# Altium project Ultra-Mega-PS-V1.00.PrjPcb
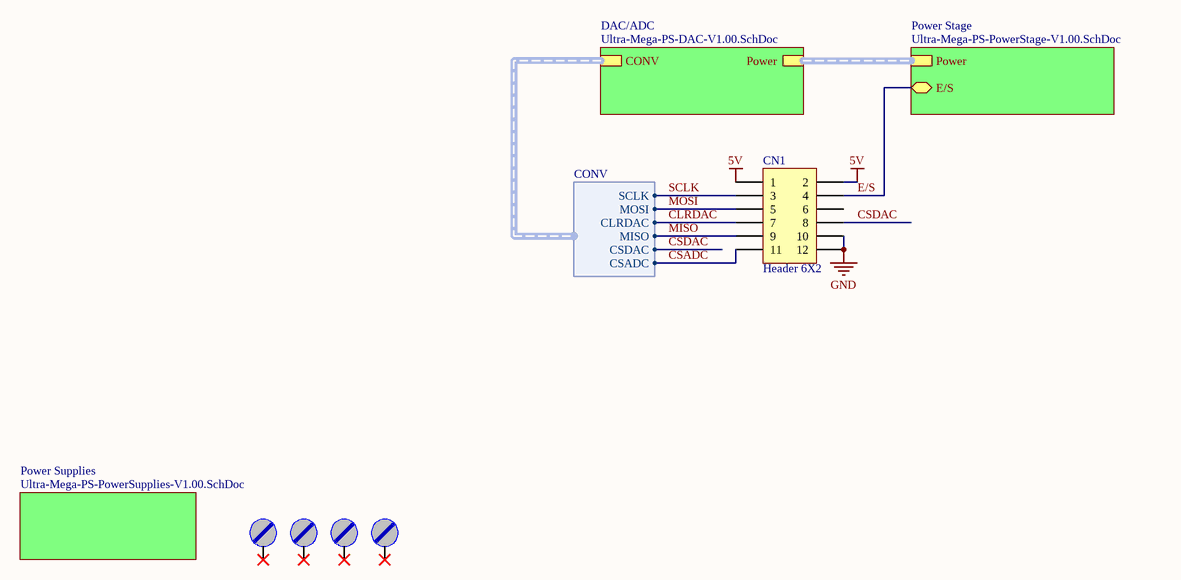
[diagram p0: Ultra-Mega-PS-Block-V1.00.SchDoc]
4 sheets, 104 parts. Net scope: hierarchical (ports join the sheet entries above them; power ports are global).
Board file: Ultra-Mega-PS-PCB.PcbDoc
Sheets:
  Ultra-Mega-PS-Block-V1.00.SchDoc
    DAC/ADC = Ultra-Mega-PS-DAC-V1.00.SchDoc
    Power Stage = Ultra-Mega-PS-PowerStage-V1.00.SchDoc
    Power Supplies = Ultra-Mega-PS-PowerSupplies-V1.00.SchDoc

## Sheet Ultra-Mega-PS-Block-V1.00.SchDoc: Ultra-Mega-PowerSupply
size A4; Author: Felipe Navarro; SheetNumber: 1; SheetTotal: 5

### Parts
CN1  Header 6X2  [CONN HDR2X6]
HOLE1  Furo de Fixação  [Furo_M3]  (value not drawn)  (no BOM)
HOLE2  Furo de Fixação  [Furo_M3]  (value not drawn)  (no BOM)
HOLE3  Furo de Fixação  [Furo_M3]  (value not drawn)  (no BOM)
HOLE4  Furo de Fixação  [Furo_M3]  (value not drawn)  (no BOM)

### Sub-sheets
DAC/ADC = Ultra-Mega-PS-DAC-V1.00.SchDoc: Power (harness Power), CONV (harness CONV)
Power Stage = Ultra-Mega-PS-PowerStage-V1.00.SchDoc: Power (harness Power), E/S
Power Supplies = Ultra-Mega-PS-PowerSupplies-V1.00.SchDoc: no entries

### Harnesses
CONV: SCLK, MOSI, CLRDAC, MISO, CSDAC, CSADC

### Nets
5V: CN1.1 CN1.2
GND: CN1.10 CN1.12
CLRDAC: CN1.7 ; sheet DAC/ADC/CONV.CLRDAC
CSADC: CN1.11 ; sheet DAC/ADC/CONV.CSADC
CSDAC: CN1.8 ; sheet DAC/ADC/CONV.CSDAC
E/S: CN1.4 ; sheet Power Stage/E/S
MISO: CN1.9 ; sheet DAC/ADC/CONV.MISO
MOSI: CN1.5 ; sheet DAC/ADC/CONV.MOSI
SCLK: CN1.3 ; sheet DAC/ADC/CONV.SCLK

Not connected (* = marked no-connect by the designer): CN1 6; HOLE1 X*; HOLE2 X*; HOLE3 X*; HOLE4 X*

### Buses and harness runs
harness sheet DAC/ADC/Power = sheet Power Stage/Power

### Notes on the sheet
- Projeto:
- Tamanho:
- Data:
- A4
- Eng. Felipe Navarro
- Hora:
- Revisão:
- Folha
- de
- Arquivo:

### Library data of the parts
CN1 = Header 6X2: Header, 6-Pin, Dual row; ChinesePrice: 0,00000; Chinês: ----; Corrente: *; Potência: *; Supplier 1: Digi-Key; Supplier Part Number 1: --Del; Tensão: *; Value: *; Obs:: *; Tolerância: *; ComponentLink1Description: Datasheet; ComponentLink1URL: D:\Tecnoclade\Datasheet\!DataMissing.pdf
HOLE1-HOLE4 = Parafuso: Furo para parafuso; Value: M3; ChinesePrice: 0,00000; Chinês: ----; Corrente: *; Potência: *; Supplier 1: Digi-Key; Supplier Part Number 1: --Del; Tensão: *; Obs:: *; Tolerância: *; ComponentLink1Description: Datasheet; ComponentLink1URL: D:\Tecnoclade\Datasheet\!DataMissing.pdf

## Sheet Ultra-Mega-PS-DAC-V1.00.SchDoc: Ultra-Mega-PowerSupply
size A4; Author: Felipe Navarro; SheetNumber: 4; SheetTotal: 5
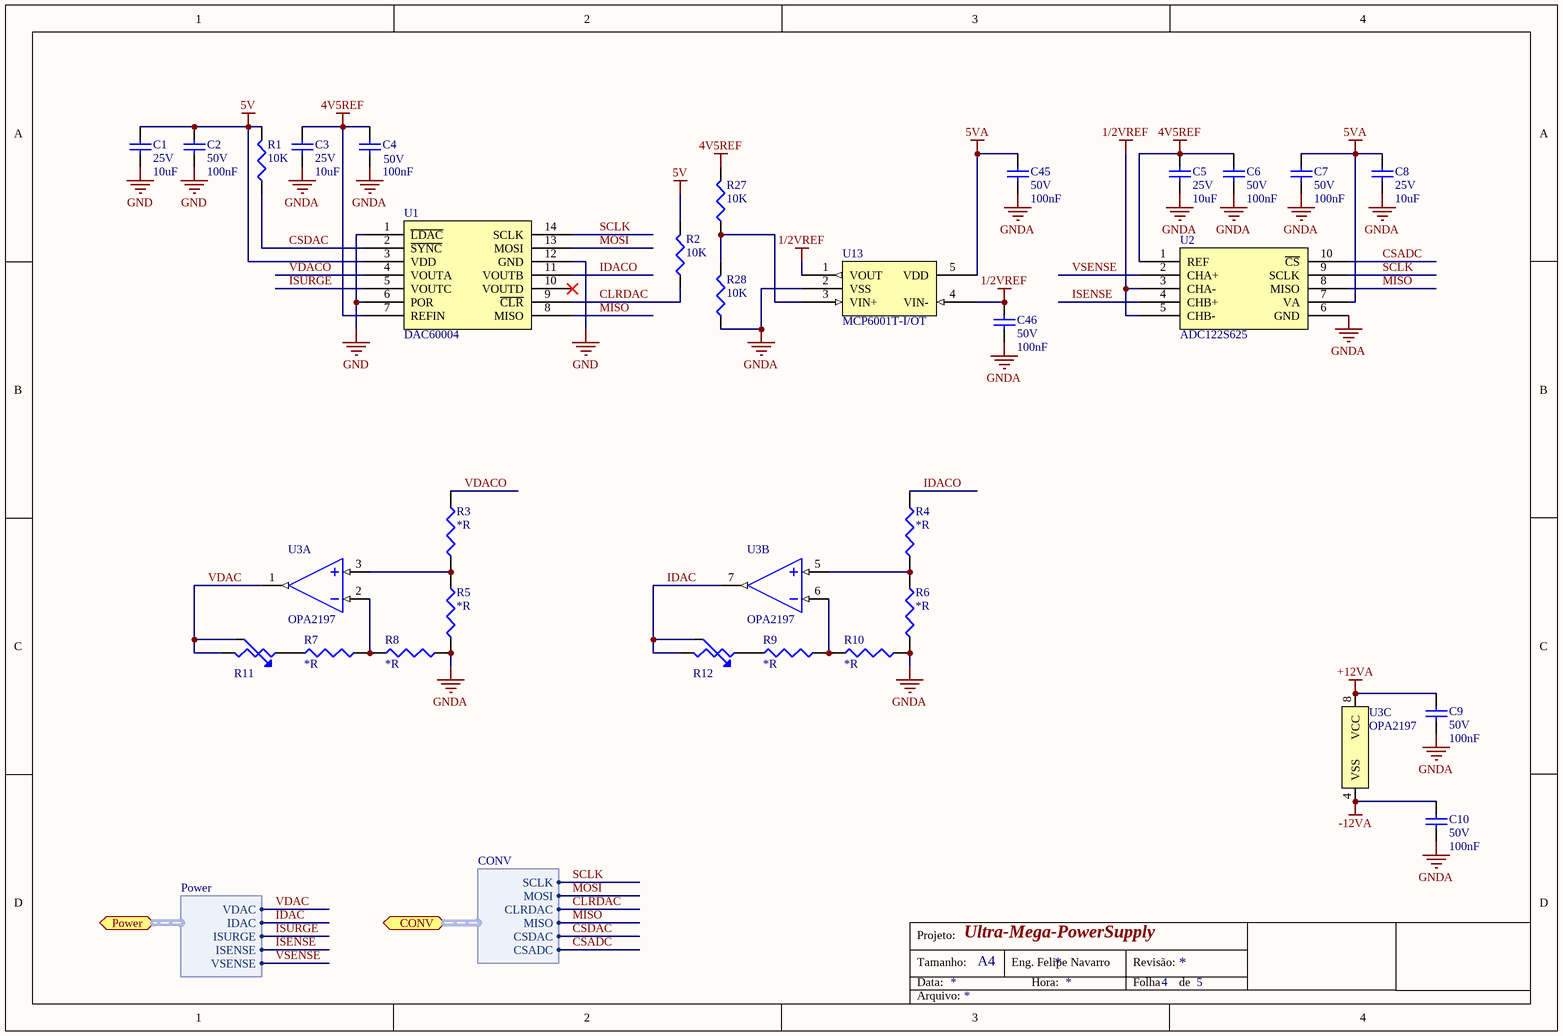
[diagram p1: Ultra-Mega-PS-DAC-V1.00.SchDoc]

### Parts
C1  value 10uF  Tensão: 25V  [CC0805]  (hidden comment: Capacitor Cerâmico)
C2  value 100nF  Tensão: 50V  [CC0603]  (hidden comment: Capacitor Cerâmico)
C3  value 10uF  Tensão: 25V  [CC0805]  (hidden comment: Capacitor Cerâmico)
C4  value 100nF  Tensão: 50V  [CC0603]  (hidden comment: Capacitor Cerâmico)
C5  value 10uF  Tensão: 25V  [CC0805]  (hidden comment: Capacitor Cerâmico)
C6  value 100nF  Tensão: 50V  [CC0603]  (hidden comment: Capacitor Cerâmico)
C7  value 100nF  Tensão: 50V  [CC0603]  (hidden comment: Capacitor Cerâmico)
C8  value 10uF  Tensão: 25V  [CC0805]  (hidden comment: Capacitor Cerâmico)
C9  value 100nF  Tensão: 50V  [CC0603]  (hidden comment: Capacitor Cerâmico)
C10  value 100nF  Tensão: 50V  [CC0603]  (hidden comment: Capacitor Cerâmico)
C45  value 100nF  Tensão: 50V  [CC0603]  (hidden comment: Capacitor Cerâmico)
C46  value 100nF  Tensão: 50V  [CC0603]  (hidden comment: Capacitor Cerâmico)
R1  value 10K  [CC0603]  (hidden comment: Resistor)
R2  value 10K  [CC0603]  (hidden comment: Resistor)
R3  value *R  [CC0603]  (hidden comment: Resistor)
R4  value *R  [CC0603]  (hidden comment: Resistor)
R5  value *R  [CC0603]  (hidden comment: Resistor)
R6  value *R  [CC0603]  (hidden comment: Resistor)
R7  value *R  [CC0603]  (hidden comment: Resistor)
R8  value *R  [CC0603]  (hidden comment: Resistor)
R9  value *R  [CC0603]  (hidden comment: Resistor)
R10  value *R  [CC0603]  (hidden comment: Resistor)
R11  Potenciômetro  [POT]  (value not drawn)
R12  Potenciômetro  [POT]  (value not drawn)
R27  value 10K  [CC0603]  (hidden comment: Resistor)
R28  value 10K  [CC0603]  (hidden comment: Resistor)
U1  DAC60004  [TSSOP-14N]
U2  ADC122S625  [MSOP10]
U3  OPA2197  [SOIC-8N]  (parts A,B,C of 3)
U13  MCP6001T-I/OT  [SOT-23-5N]

### Ports
CONV (harness CONV), Power (harness Power)

### Harnesses
Power: VDAC, IDAC, ISENSE, VSENSE, ISURGE
CONV: SCLK, MOSI, CLRDAC, MISO, CSDAC, CSADC

### Nets
1/2VREF: C46.2 U2.3(CHA-) U2.5(CHB-) U13.1(VOUT) U13.4(VIN-)
4V5REF: C3.2 C4.2 C5.2 C6.2 R27.2 U1.7(REFIN) U2.1(REF)
5V: C1.2 C2.2 R1.2 R2.2 U1.3(VDD)
5VA: C7.2 C8.2 C45.2 U2.7(VA) U13.5(VDD)
+12VA: C9.2 U3.8(VCC)
-12VA: C10.2 U3.4(VSS)
GND: C1.1 C2.1 U1.1(~{LDAC}) U1.6(POR) U1.12(GND)
GNDA: C3.1 C4.1 C5.1 C6.1 C7.1 C8.1 C9.1 C10.1 C45.1 C46.1 R5.1 R6.1 R8.2 R10.2 R28.1 U2.6(GND) U13.2(VSS)
CLRDAC: R2.1 U1.9(~{CLR}) ; port CONV.CLRDAC
CSADC: U2.10(~{CS}) ; port CONV.CSADC
CSDAC: R1.1 U1.2(~{SYNC}) ; port CONV.CSDAC
IDAC: R12.2(TAP) R12.3 U3.7(OUTB) ; port Power.IDAC
IDACO: R4.2 U1.11(VOUTB)
ISENSE: U2.4(CHB+) ; port Power.ISENSE
ISURGE: U1.5(VOUTC) ; port Power.ISURGE
MISO: U1.8(MISO) U2.8(MISO) ; port CONV.MISO
MOSI: U1.13(MOSI) ; port CONV.MOSI
SCLK: U1.14(SCLK) U2.9(SCLK) ; port CONV.SCLK
VDAC: R11.2(TAP) R11.3 U3.1(OUTA) ; port Power.VDAC
VDACO: R3.2 U1.4(VOUTA)
VSENSE: U2.2(CHA+) ; port Power.VSENSE
NetR3_1: R3.1 R5.2 U3.3(INA+)
NetR4_1: R4.1 R6.2 U3.5(INB+)
NetR7_1: R7.1 R11.1
NetR7_2: R7.2 R8.1 U3.2(INA-)
NetR9_1: R9.1 R12.1
NetR9_2: R9.2 R10.1 U3.6(INB-)
NetR27_1: R27.1 R28.2 U13.3(VIN+)

Not connected (* = marked no-connect by the designer): U1 10(VOUTD)*

### Notes on the sheet
- Projeto:
- Tamanho:
- Data:
- A4
- Eng. Felipe Navarro
- Hora:
- Revisão:
- Folha
- de
- Arquivo:

### Library data of the parts
C1 C3 C5 C8 = Cap 10uF 25V 0805 X5R: Capacitor (Semiconductor SIM Model); Chinês: Local; ChinesePrice: 0,02620; Corrente: *A; Potência: *W; Obs:: X5R; Tolerância: ±10%; Supplier 1: Digi-Key; Supplier Part Number 1: 587-2985-1-ND; ComponentLink1Description: Datasheet; ComponentLink1URL: D:\Tecnoclade\Datasheet\!DataMissing.pdf
C2 C4 C6 C7 C9 C10 C45 C46 = Cap 100nF 50V 0603 X7R: Capacitor (Semiconductor SIM Model); Chinês: Local; ChinesePrice: 0,00250; Corrente: *A; Potência: *W; Obs:: X7R; Tolerância: ±10%; Supplier 1: Digi-Key; Supplier Part Number 1: 1276-1000-1-ND; ComponentLink1Description: Datasheet; ComponentLink1URL: D:\Tecnoclade\Datasheet\!DataMissing.pdf
R1 R2 R27 R28 = Res 10K 1% 0603 1/10W: ChinesePrice: 0,00089; Chinês: Local; Corrente: *A; Potência: 1/10W; Tensão: *V; Tolerância: ±1%; Supplier 1: Digi-Key; Supplier Part Number 1: P10.0KHCT-ND; Obs: *; ComponentLink1Description: Datasheet; ComponentLink1URL: D:\Tecnoclade\Datasheet\!DataMissing.pdf
R3-R10 = Res - $Val $% $Footprint $Pot: ChinesePrice: 0,00000; Chinês: ----; Corrente: *A; Potência: 1/10W; Tensão: *V; Tolerância: ±*%; Supplier 1: Digi-Key; Supplier Part Number 1: --Del; Obs:: *; ComponentLink1Description: Datasheet; ComponentLink1URL: D:\Tecnoclade\Datasheet\!DataMissing.pdf
R11 R12 = Res Trim: Trimmer; ChinesePrice: 0,00000; Chinês: ----; Corrente: *A; Potência: *W; Tensão: *V; Tolerância: ±*%; Value: 1K; Supplier 1: Digi-Key; Supplier Part Number 1: --Del; Obs: *; ComponentLink1Description: Datasheet; ComponentLink1URL: D:\Tecnoclade\Datasheet\!DataMissing.pdf
U1 = DAC6004: DACx0004, Quad 16-,14-,12-Bit, 1 LSB INL, Buffered, Voltage-Output Digital-to-Analog  Converters; ChinesePrice: 0,00000; Chinês: ----; Supplier 1: Digi-Key; Supplier Part Number 1: *; Corrente: *; Potência: *; Tensão: *; Value: *; Obs:: *; Tolerância: *; ComponentLink1Description: Datasheet; ComponentLink1URL: D:\Tecnoclade\Datasheet\
U2 = ADC122S625: ADC122S625 Dual 12-Bit, 50 kSPS to 200 kSPS, Simultaneous Sampling A/D Converter; ChinesePrice: 0,00000; Chinês: ----; Supplier 1: Digi-Key; Corrente: *; Potência: *; Tensão: *; Value: *; Obs:: *; Tolerância: *; ComponentLink1Description: Datasheet; ComponentLink1URL: D:\Tecnoclade\Datasheet\
U3 = OPA2197: OPAx197 36-V, Precision, Rail-to-Rail Input/Output, Low Offset Voltage, Operational Amplifiers; Chinês: ----; ChinesePrice: 0,00000; Tensão: 36V; Value: 10MHz; Corrente: 65mA; Potência: *; Supplier 1: Digi-Key; Obs:: Rail-To-Rail; Tolerância: *; ComponentLink1Description: Datasheet; ComponentLink1URL: D:\Tecnoclade\Datasheet\
U13 = MCP6001: 1 MHz, Low-Power Op Amp; ChinesePrice: 0,00000; Chinês: ----; Tensão: 3V75 ~ 6V; Corrente: 500mA; Obs:: +; Potência: *; Value: *; Supplier 1: Digi-Key; Supplier Part Number 1: MCP6001T-I/OTCT-ND; Tolerância: *; ComponentLink1Description: Datasheet; ComponentLink1URL: http://ww1.microchip.com/downloads/en/DeviceDoc/21733j.pdf

## Sheet Ultra-Mega-PS-PowerStage-V1.00.SchDoc: Ultra-Mega-PowerSupply
size A4; Author: Felipe Navarro; Revision: 1.0; SheetNumber: 5; SheetTotal: 5; ProjectName: Ultra-Mega-Power-Supply
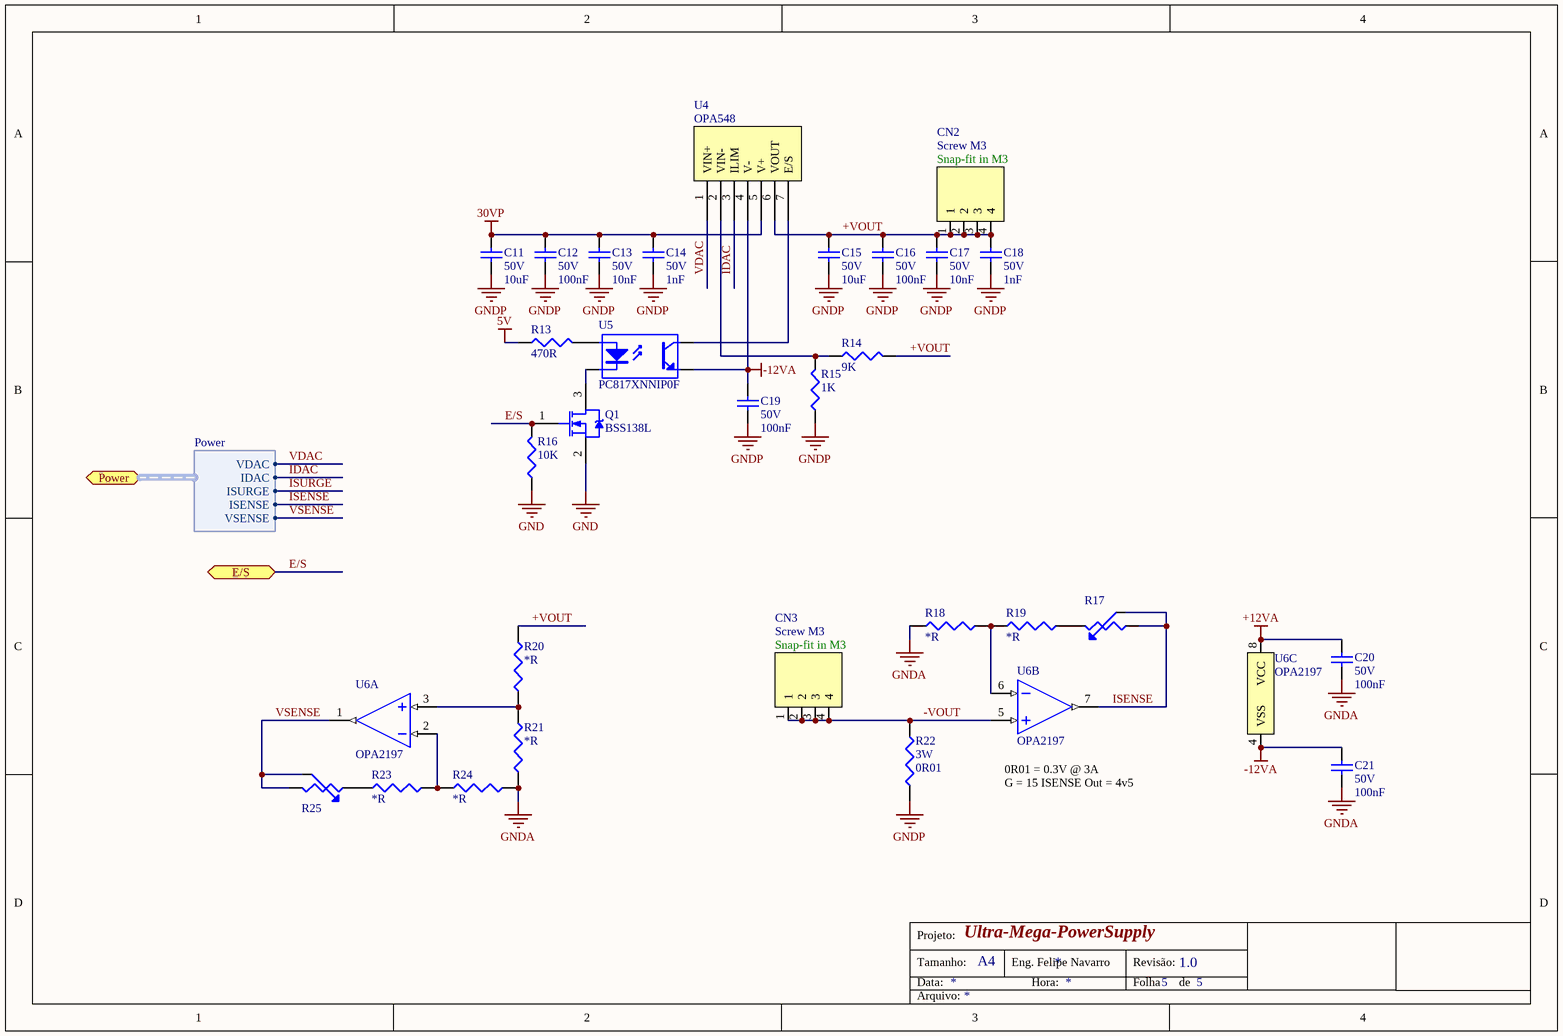
[diagram p2: Ultra-Mega-PS-PowerStage-V1.00.SchDoc]

### Parts
C11  value 10uF  Tensão: 50V  [CC1206]  (hidden comment: Capacitor Cerâmico)
C12  value 100nF  Tensão: 50V  [CC0603]  (hidden comment: Capacitor Cerâmico)
C13  value 10nF  Tensão: 50V  [CC0603]  (hidden comment: Capacitor Cerâmico)
C14  value 1nF  Tensão: 50V  [CC0603]  (hidden comment: Capacitor Cerâmico)
C15  value 10uF  Tensão: 50V  [CC1206]  (hidden comment: Capacitor Cerâmico)
C16  value 100nF  Tensão: 50V  [CC0603]  (hidden comment: Capacitor Cerâmico)
C17  value 10nF  Tensão: 50V  [CC0603]  (hidden comment: Capacitor Cerâmico)
C18  value 1nF  Tensão: 50V  [CC0603]  (hidden comment: Capacitor Cerâmico)
C19  value 100nF  Tensão: 50V  [CC0603]  (hidden comment: Capacitor Cerâmico)
C20  value 100nF  Tensão: 50V  [CC0603]  (hidden comment: Capacitor Cerâmico)
C21  value 100nF  Tensão: 50V  [CC0603]  (hidden comment: Capacitor Cerâmico)
CN2  Screw M3  value Snap-fit in M3  [CONN_MASSA-M3]
CN3  Screw M3  value Snap-fit in M3  [CONN_MASSA-M3]
Q1  BSS138L  [SOT-23-3N]
R13  value 470R  [CC0603]  (hidden comment: Resistor)
R14  value 9K  [CC0603]  (hidden comment: Resistor)
R15  value 1K  [CC0603]  (hidden comment: Resistor)
R16  value 10K  [CC0603]  (hidden comment: Resistor)
R17  Potenciômetro  [POT]  (value not drawn)
R18  value *R  [CC0603]  (hidden comment: Resistor)
R19  value *R  [CC0603]  (hidden comment: Resistor)
R20  value *R  [CC0603]  (hidden comment: Resistor)
R21  value *R  [CC0603]  (hidden comment: Resistor)
R22  value 0R01  Potência: 3W  [CC2512]  (hidden comment: Resistor)
R23  value *R  [CC0603]  (hidden comment: Resistor)
R24  value *R  [CC0603]  (hidden comment: Resistor)
R25  Potenciômetro  [POT]  (value not drawn)
U4  OPA548  [TO-220-7N]
U5  PC817XNNIP0F  [SMD-4N]
U6  OPA2197  [SOIC-8N]  (parts A,B,C of 3)

### Ports
E/S, Power (harness Power)

### Harnesses
Power: VDAC, IDAC, ISENSE, VSENSE, ISURGE

### Nets
5V: R13.1
30VP: C11.2 C12.2 C13.2 C14.2 U4.5(V+)
+12VA: C20.2 U6.8(VCC)
-12VA: C19.2 C21.2 U4.4(V-) U5.3(S) U6.4(VSS)
GND: Q1.2(S) R16.1
GNDA: C20.1 C21.1 R18.1 R21.1 R24.2
GNDP: C11.1 C12.1 C13.1 C14.1 C15.1 C16.1 C17.1 C18.1 C19.1 R15.1 R22.1
+VOUT: C15.2 C16.2 C17.2 C18.2 CN2.1 CN2.2 CN2.3 CN2.4 R14.1 R20.2 U4.6(VOUT)
-VOUT: CN3.1 CN3.2 CN3.3 CN3.4 R22.2 U6.5(INB+)
E/S: Q1.1(G) R16.2 ; port E/S
IDAC: U4.3(ILIM) ; port Power.IDAC
ISENSE: R17.2(TAP) R17.3 U6.7(OUTB) ; port Power.ISENSE
VDAC: U4.1(VIN+) ; port Power.VDAC
VSENSE: R25.2(TAP) R25.3 U6.1(OUTA) ; port Power.VSENSE
NetQ1_3: Q1.3(D) U5.2(K)
NetR13_2: R13.2 U5.1(A)
NetR14_2: R14.2 R15.2 U4.2(VIN-)
NetR17_1: R17.1 R19.2
NetR18_2: R18.2 R19.1 U6.6(INB-)
NetR20_1: R20.1 R21.2 U6.3(INA+)
NetR23_1: R23.1 R25.1
NetR23_2: R23.2 R24.1 U6.2(INA-)
NetU4_7: U4.7(E/S) U5.4(D)

### Notes on the sheet
- (near U6) 0R01 = 0.3V @ 3A
  G = 15 ISENSE Out = 4v5
- Projeto:
- Tamanho:
- Data:
- A4
- Eng. Felipe Navarro
- Hora:
- Revisão:
- Folha
- de
- Arquivo:

### Library data of the parts
C11 C15 = Cap 10uF 50V 1206 X5R: Capacitor (Semiconductor SIM Model); Chinês: -----; ChinesePrice: 0,00000; Corrente: *A; Potência: *W; Obs:: X5R, CL31A106KBHNNNE; Tolerância: ±10%; Supplier 1: Digi-Key; Supplier Part Number 1: 1276-2876-1-ND; ComponentLink1Description: Datasheet; ComponentLink1URL: D:\Tecnoclade\Datasheet\!DataMissing.pdf
C12 C16 C19-C21 = Cap 100nF 50V 0603 X7R: as C2 on sheet Ultra-Mega-PS-DAC-V1.00; Supplier 1: Digi-Key; Supplier Part Number 1: 1276-1000-1-ND; ComponentLink1Description: Datasheet; ComponentLink1URL: D:\Tecnoclade\Datasheet\!DataMissing.pdf
C13 C17 = Cap 10nF 50V 0603 X7R 5%: Capacitor (Semiconductor SIM Model); Chinês: Local; ChinesePrice: 0,00320; Corrente: *A; Potência: *W; Obs:: X7R; Tolerância: ±5%; Supplier 1: Digi-Key; Supplier Part Number 1: 399-1092-1-ND; ComponentLink1Description: Datasheet; ComponentLink1URL: D:\Tecnoclade\Datasheet\!DataMissing.pdf
C14 C18 = Cap 1nF 50V 0603 X7R: Capacitor (Semiconductor SIM Model); Chinês: -----; ChinesePrice: 0,00000; Corrente: *A; Potência: *W; Obs:: X7R; Tolerância: ±10%; Supplier 1: Digi-Key; Supplier Part Number 1: 1276-1916-1-ND; ComponentLink1Description: Datasheet; ComponentLink1URL: D:\Tecnoclade\Datasheet\!DataMissing.pdf
CN2 CN3 = Screw Snap-Fit M3: TERM PCB SNAP-IN VERT M3 THREAD; ChinesePrice: 0,00000; Chinês: -----; Corrente: 15A; Obs:: Screw Terminal, Power Tap; Potência: *; Supplier 1: Digi-Key; Supplier Part Number 1: 7788K-ND; Tensão: *; Tolerância: *; ComponentLink1Description: Datasheet; ComponentLink1URL: D:\Tecnoclade\Datasheet\!DataMissing.pdf
Q1 = TRS BSS138 50V 200mA SOT-23-3N: N-Channel Power MOSFET; ChinesePrice: 0,02950; Chinês: Local; Corrente: 200mA; Potência: 1/5W; Tensão: 50V; Supplier 1: Digi-Key; Supplier Part Number 1: BSS138LT3GOSCT-ND; Value: *; Obs:: *; Tolerância: *; ComponentLink1Description: Datasheet; ComponentLink1URL: D:\Tecnoclade\Datasheet\!DataMissing.pdf
R13 = Res 470R 5% 0603 1/10W: ChinesePrice: 0,00000; Chinês: ----; Corrente: *A; Potência: 1/10W; Tensão: *V; Obs: ±200ppm/ºC; Tolerância: ±5%; Supplier 1: Digi-Key; Supplier Part Number 1: RMCF0603JT470RCT-ND; ComponentLink1Description: Datasheet; ComponentLink1URL: D:\Tecnoclade\Datasheet\!DataMissing.pdf
R14 = Res 9K09 1% 0603 1/10W: ChinesePrice: 0,00000; Chinês: ----; Corrente: *A; Potência: 1/10W; Tensão: *V; Obs: ±100ppm/ºC; Tolerância: ±1%; Supplier 1: Digi-Key; Supplier Part Number 1: RMCF0603FT9K0CT-ND; ComponentLink1Description: Datasheet; ComponentLink1URL: D:\Tecnoclade\Datasheet\!DataMissing.pdf
R15 = Res 1K 1% 0603 1/10W: ChinesePrice: 0,00089; Chinês: Local; Corrente: *A; Potência: 1/10W; Tensão: *V; Tolerância: ±1%; Supplier 1: Digi-Key; Supplier Part Number 1: RMCF0603FT1K00CT-ND; Obs: *; ComponentLink1Description: Datasheet; ComponentLink1URL: D:\Tecnoclade\Datasheet\!DataMissing.pdf
R16 = Res 10K 1% 0603 1/10W: as R1 on sheet Ultra-Mega-PS-DAC-V1.00; Supplier 1: Digi-Key; Supplier Part Number 1: P10.0KHCT-ND; Obs: *; ComponentLink1Description: Datasheet; ComponentLink1URL: D:\Tecnoclade\Datasheet\!DataMissing.pdf
R17 R25 = Res Trim: as R11 on sheet Ultra-Mega-PS-DAC-V1.00; Supplier 1: Digi-Key; Supplier Part Number 1: --Del; Obs: *; ComponentLink1Description: Datasheet; ComponentLink1URL: D:\Tecnoclade\Datasheet\!DataMissing.pdf
R18-R21 R23 R24 = Res - $Val $% $Footprint $Pot: as R3 on sheet Ultra-Mega-PS-DAC-V1.00; Supplier 1: Digi-Key; Supplier Part Number 1: --Del; Obs:: *; ComponentLink1Description: Datasheet; ComponentLink1URL: D:\Tecnoclade\Datasheet\!DataMissing.pdf
R22 = Res 0R01 1% 2512 3W: ChinesePrice: 0,00000; Chinês: ----; Corrente: *A; Tensão: *V; Tolerância: 1%; Supplier 1: Digi-Key; Supplier Part Number 1: 696-1185-1-ND; Obs:: *; ComponentLink1Description: Datasheet; ComponentLink1URL: D:\Tecnoclade\Datasheet\!DataMissing.pdf
U4 = OPA548: High-Voltage, High-Current  OPERATIONAL AMPLIFIER; ChinesePrice: 0,00000; Chinês: ----; Supplier 1: Digi-Key; Supplier Part Number 1: OPA548T-ND; Corrente: *; Potência: *; Tensão: *; Value: *; Obs:: *; Tolerância: *; ComponentLink1Description: Datasheet; ComponentLink1URL: D:\Tecnoclade\Datasheet\
U5 = OPT PC817: 4-Pin Phototransistor Optocoupler; ChinesePrice: 0,00000; Chinês: ----; Corrente: *; Potência: *; Supplier 1: Digi-Key; Supplier Part Number 1: 425-2774-1-ND; Tensão: *; Value: *; Obs:: *; Tolerância: *; ComponentLink1Description: Datasheet; ComponentLink1URL: D:\Tecnoclade\Datasheet\!DataMissing.pdf
U6 = OPA2197: as U3 on sheet Ultra-Mega-PS-DAC-V1.00; Potência: *; Supplier 1: Digi-Key; Obs:: Rail-To-Rail; Tolerância: *; ComponentLink1Description: Datasheet; ComponentLink1URL: D:\Tecnoclade\Datasheet\

## Sheet Ultra-Mega-PS-PowerSupplies-V1.00.SchDoc: Ultra-Mega-PowerSupply
size A4; Author: Felipe Navarro; SheetNumber: 2; SheetTotal: 5
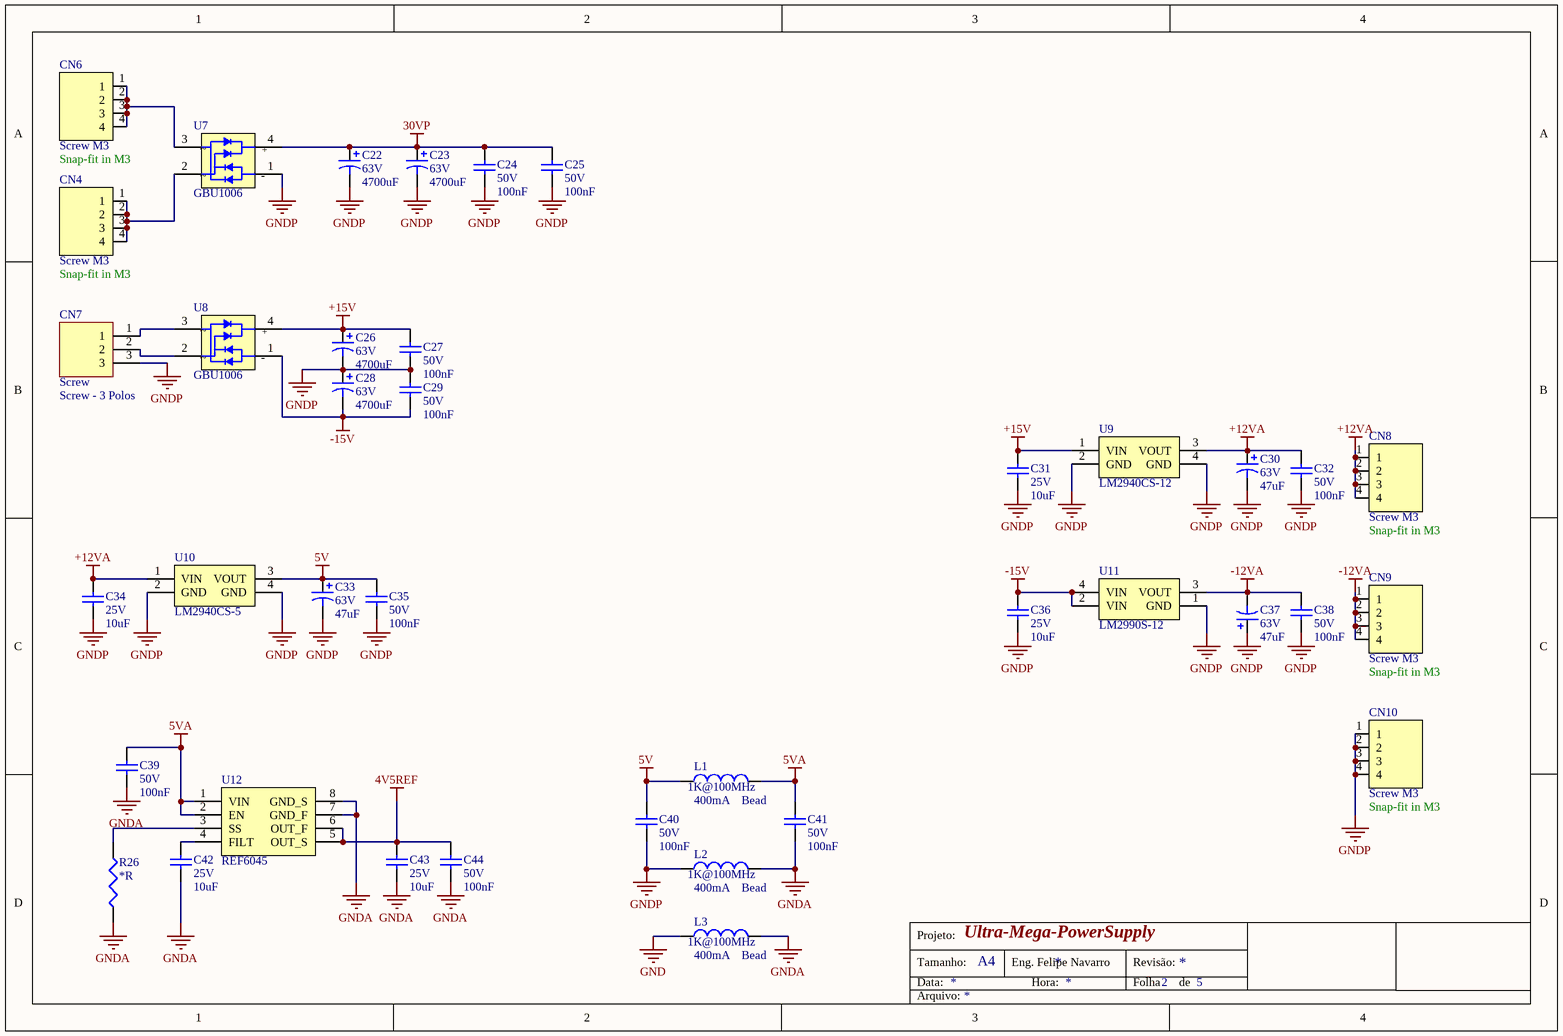
[diagram p3: Ultra-Mega-PS-PowerSupplies-V1.00.SchDoc]

### Parts
C22  value 4700uF  Tensão: 63V  [CAP NICHICON 25x40]  (hidden comment: Capacitor Eletrolítico)
C23  value 4700uF  Tensão: 63V  [CAP NICHICON 25x40]  (hidden comment: Capacitor Eletrolítico)
C24  value 100nF  Tensão: 50V  [CC0603]  (hidden comment: Capacitor Cerâmico)
C25  value 100nF  Tensão: 50V  [CC0603]  (hidden comment: Capacitor Cerâmico)
C26  value 4700uF  Tensão: 63V  [CAP NICHICON 25x40]  (hidden comment: Capacitor Eletrolítico)
C27  value 100nF  Tensão: 50V  [CC0603]  (hidden comment: Capacitor Cerâmico)
C28  value 4700uF  Tensão: 63V  [CAP NICHICON 25x40]  (hidden comment: Capacitor Eletrolítico)
C29  value 100nF  Tensão: 50V  [CC0603]  (hidden comment: Capacitor Cerâmico)
C30  value 47uF  Tensão: 63V  [CPOLRAD6X12]  (hidden comment: Capacitor Eletrolítico)
C31  value 10uF  Tensão: 25V  [CC0805]  (hidden comment: Capacitor Cerâmico)
C32  value 100nF  Tensão: 50V  [CC0603]  (hidden comment: Capacitor Cerâmico)
C33  value 47uF  Tensão: 63V  [CPOLRAD6X12]  (hidden comment: Capacitor Eletrolítico)
C34  value 10uF  Tensão: 25V  [CC0805]  (hidden comment: Capacitor Cerâmico)
C35  value 100nF  Tensão: 50V  [CC0603]  (hidden comment: Capacitor Cerâmico)
C36  value 10uF  Tensão: 25V  [CC0805]  (hidden comment: Capacitor Cerâmico)
C37  value 47uF  Tensão: 63V  [CPOLRAD6X12]  (hidden comment: Capacitor Eletrolítico)
C38  value 100nF  Tensão: 50V  [CC0603]  (hidden comment: Capacitor Cerâmico)
C39  value 100nF  Tensão: 50V  [CC0603]  (hidden comment: Capacitor Cerâmico)
C40  value 100nF  Tensão: 50V  [CC0603]  (hidden comment: Capacitor Cerâmico)
C41  value 100nF  Tensão: 50V  [CC0603]  (hidden comment: Capacitor Cerâmico)
C42  value 10uF  Tensão: 25V  [CC0805]  (hidden comment: Capacitor Cerâmico)
C43  value 10uF  Tensão: 25V  [CC0805]  (hidden comment: Capacitor Cerâmico)
C44  value 100nF  Tensão: 50V  [CC0603]  (hidden comment: Capacitor Cerâmico)
CN4  Screw M3  value Snap-fit in M3  [CONN_MASSA-M3]
CN6  Screw M3  value Snap-fit in M3  [CONN_MASSA-M3]
CN7  Screw  value Screw - 3 Polos  [CONN SCREW-3N P5.08]
CN8  Screw M3  value Snap-fit in M3  [CONN_MASSA-M3]
CN9  Screw M3  value Snap-fit in M3  [CONN_MASSA-M3]
CN10  Screw M3  value Snap-fit in M3  [CONN_MASSA-M3]
L1  Bead  value 1K@100MHz  Corrente: 400mA  [CC0603]
L2  Bead  value 1K@100MHz  Corrente: 400mA  [CC0603]
L3  Bead  value 1K@100MHz  Corrente: 400mA  [CC0603]
R26  value *R  [CC0603]  (hidden comment: Resistor)
U7  GBU1006  [GBU1006]
U8  GBU1006  [GBU1006]
U9  LM2940CS-12  [TO263-4N]
U10  LM2940CS-5  [TO263-4N]
U11  LM2990S-12  [TO263-4N]
U12  REF6045  [VFSOP-8N]

### Nets
4V5REF: C43.2 C44.2 U12.5(OUT_S) U12.6(OUT_F)
5V: C33.1 C35.2 C40.2 L1.1 U10.3(VOUT)
5VA: C39.2 C41.2 L1.2 U12.1(VIN) U12.2(EN)
30VP: C22.2 C23.2 C24.2 C25.2 U7.4(G)
+12VA: C30.1 C32.2 C34.2 CN8.1 CN8.2 CN8.3 CN8.4 U9.3(VOUT) U10.1(VIN)
+15V: C26.2 C27.2 C31.2 U8.4(G) U9.1(VIN)
-12VA: C37.2 C38.2 CN9.1 CN9.2 CN9.3 CN9.4 U11.3(VOUT)
-15V: C28.1 C29.1 C36.2 U8.1(S) U11.2(VIN) U11.4(VIN)
GND: L3.1
GNDA: C39.1 C41.1 C42.1 C43.1 C44.1 L2.2 L3.2 R26.1 U12.7(GND_F) U12.8(GND_S)
GNDP: C22.1 C23.1 C24.1 C25.1 C26.1 C27.1 C28.2 C29.2 C30.2 C31.1 C32.1 C33.2 C34.1 C35.1 C36.1 C37.1 C38.1 C40.1 CN7.3 CN10.1 CN10.2 CN10.3 CN10.4 L2.1 U7.1(S) U9.2(GND) U9.4(GND) U10.2(GND) U10.4(GND) U11.1(GND)
NetC42_2: C42.2 U12.4(FILT)
NetCN4_1: CN4.1 CN4.2 CN4.3 CN4.4 U7.2(AC)
NetCN6_1: CN6.1 CN6.2 CN6.3 CN6.4 U7.3(AC)
NetCN7_1: CN7.1 U8.3(AC)
NetCN7_2: CN7.2 U8.2(AC)
NetR26_2: R26.2 U12.3(SS)

### Notes on the sheet
- Projeto:
- Tamanho:
- Data:
- A4
- Eng. Felipe Navarro
- Hora:
- Revisão:
- Folha
- de
- Arquivo:
- (in symbol BRG GBU1006 600V 10A) ~; +; -

### Library data of the parts
C22 C23 C26 C28 = PCap 4700uF 63V: Polarized Capacitor (Radial); ChinesePrice: 0,00000; Chinês: ----; Corrente: *A; Potência: *W; Obs: ESH477M010AE3AA - Alumínio; Tolerância: ±20%; Supplier 1: Digi-Key; ComponentLink1Description: Datasheet; ComponentLink1URL: D:\Tecnoclade\Datasheet\!DataMissing.pdf
C24 C25 C27 C29 C32 C35 C38-C41 C44 = Cap 100nF 50V 0603 X7R: as C2 on sheet Ultra-Mega-PS-DAC-V1.00; Supplier 1: Digi-Key; Supplier Part Number 1: 1276-1000-1-ND; ComponentLink1Description: Datasheet; ComponentLink1URL: D:\Tecnoclade\Datasheet\!DataMissing.pdf
C30 C33 C37 = PCap 47uF 63V 6d.x12h.: Polarized Capacitor (Radial); ChinesePrice: 0,00000; Chinês: ----; Corrente: *A; Potência: *W; Obs: Alumínio; Tolerância: ±20%; Supplier 1: Digi-Key; Supplier Part Number 1: 493-12934-1-ND; ComponentLink1Description: Datasheet; ComponentLink1URL: D:\Tecnoclade\Datasheet\!DataMissing.pdf
C31 C34 C36 C42 C43 = Cap 10uF 25V 0805 X5R: as C1 on sheet Ultra-Mega-PS-DAC-V1.00; Supplier 1: Digi-Key; Supplier Part Number 1: 587-2985-1-ND; ComponentLink1Description: Datasheet; ComponentLink1URL: D:\Tecnoclade\Datasheet\!DataMissing.pdf
CN4 CN6 CN8-CN10 = Screw Snap-Fit M3: as CN2 on sheet Ultra-Mega-PS-PowerStage-V1.00; Potência: *; Supplier 1: Digi-Key; Supplier Part Number 1: 7788K-ND; Tensão: *; Tolerância: *; ComponentLink1Description: Datasheet; ComponentLink1URL: D:\Tecnoclade\Datasheet\!DataMissing.pdf
CN7 = Screw-3 125V 6A P2.54mm: Conector Screw Block; ChinesePrice: 0,00000; Chinês: ----; Corrente: 6A; Tensão: 125V; Obs:: Through Hole, M1.6; Tolerância: 20-30 AWG; Potência: *; Supplier 1: Digi-Key; ComponentLink1Description: Datasheet; ComponentLink1URL: D:\Tecnoclade\Datasheet\!DataMissing.pdf
L1-L3 = Bd 1K@100MHz 0603 400mA: ChinesePrice: 0,00000; Chinês: -----; Obs:: Ferrite (0R5); Tolerância: ±25%; Potência: *; Supplier 1: Digi-Key; Supplier Part Number 1: 445-1550-1-ND; Tensão: *; ComponentLink1Description: Datasheet; ComponentLink1URL: D:\Tecnoclade\Datasheet\!DataMissing.pdf; Substituição: 27/06/2014
R26 = Res - $Val $% $Footprint $Pot: as R3 on sheet Ultra-Mega-PS-DAC-V1.00; Supplier 1: Digi-Key; Supplier Part Number 1: --Del; Obs:: *; ComponentLink1Description: Datasheet; ComponentLink1URL: D:\Tecnoclade\Datasheet\!DataMissing.pdf
U7 U8 = BRG GBU1006 600V 10A: 600V 10A; ChinesePrice: 0,00000; Chinês: ----; Corrente: 500mA; Potência: *W; Tensão: 20V; Value: Ponte Retificadora; Tolerância: ±*%; Supplier 1: Digi-Key; Supplier Part Number 1: GBU1006DI-ND; Obs:: *; ComponentLink1Description: Datasheet; ComponentLink1URL: D:\Tecnoclade\Datasheet\!DataMissing.pdf
U9 U10 = LM2940-15: Regulador Linear 15V Positivo; Chinês: ----; Corrente: 1A; ChinesePrice: 0,00000; Obs:: LDO; Potência: *; Value: *; Supplier 1: Digi-Key; Supplier Part Number 1: LM2940CS-15/NOPB-ND; Tensão: 15V; Tolerância: *; ComponentLink1Description: Datasheet; ComponentLink1URL: D:\Tecnoclade\Datasheet\
U11 = LM2990-15: Regulador Linear 15V Negativo; Chinês: ----; Tensão: -15V; Corrente: 1.8A; ChinesePrice: 0,00000; Obs:: LDO; Potência: *; Value: *; Supplier 1: Digi-Key; Supplier Part Number 1: LM2990S-15/NOPB-ND; Tolerância: *; ComponentLink1Description: Datasheet; ComponentLink1URL: D:\Tecnoclade\Datasheet\
U12 = REF6050: REF60xx High-Precision Voltage Reference With Integrated ADC Drive Buffer; ChinesePrice: 1,94000; Chinês: Local; Corrente: *; Potência: *; Supplier 1: Digi-Key; Supplier Part Number 1: *; Tensão: *; Obs:: *; Tolerância: *; ComponentLink1Description: Datasheet; ComponentLink1URL: D:\Tecnoclade\Datasheet\!DataMissing.pdf

## Nets that join several sheets
4V5REF: Ultra-Mega-PS-DAC-V1.00 (7 pins), Ultra-Mega-PS-PowerSupplies-V1.00 (C43.2 C44.2 U12.5 U12.6)
5V: Ultra-Mega-PS-Block-V1.00 (CN1.1 CN1.2), Ultra-Mega-PS-DAC-V1.00 (5 pins), Ultra-Mega-PS-PowerStage-V1.00 (R13.1), Ultra-Mega-PS-PowerSupplies-V1.00 (5 pins)
5VA: Ultra-Mega-PS-DAC-V1.00 (5 pins), Ultra-Mega-PS-PowerSupplies-V1.00 (5 pins)
30VP: Ultra-Mega-PS-PowerStage-V1.00 (5 pins), Ultra-Mega-PS-PowerSupplies-V1.00 (5 pins)
+12VA: Ultra-Mega-PS-DAC-V1.00 (C9.2 U3.8), Ultra-Mega-PS-PowerStage-V1.00 (C20.2 U6.8), Ultra-Mega-PS-PowerSupplies-V1.00 (9 pins)
-12VA: Ultra-Mega-PS-DAC-V1.00 (C10.2 U3.4), Ultra-Mega-PS-PowerStage-V1.00 (5 pins), Ultra-Mega-PS-PowerSupplies-V1.00 (7 pins)
GND: Ultra-Mega-PS-Block-V1.00 (CN1.10 CN1.12), Ultra-Mega-PS-DAC-V1.00 (5 pins), Ultra-Mega-PS-PowerStage-V1.00 (Q1.2 R16.1), Ultra-Mega-PS-PowerSupplies-V1.00 (L3.1)
GNDA: Ultra-Mega-PS-DAC-V1.00 (17 pins), Ultra-Mega-PS-PowerStage-V1.00 (5 pins), Ultra-Mega-PS-PowerSupplies-V1.00 (10 pins)
GNDP: Ultra-Mega-PS-PowerStage-V1.00 (11 pins), Ultra-Mega-PS-PowerSupplies-V1.00 (30 pins)
CLRDAC: Ultra-Mega-PS-Block-V1.00 (CN1.7), Ultra-Mega-PS-DAC-V1.00 (R2.1 U1.9)
CSADC: Ultra-Mega-PS-Block-V1.00 (CN1.11), Ultra-Mega-PS-DAC-V1.00 (U2.10)
CSDAC: Ultra-Mega-PS-Block-V1.00 (CN1.8), Ultra-Mega-PS-DAC-V1.00 (R1.1 U1.2)
E/S: Ultra-Mega-PS-Block-V1.00 (CN1.4), Ultra-Mega-PS-PowerStage-V1.00 (Q1.1 R16.2)
IDAC: Ultra-Mega-PS-DAC-V1.00 (R12.2 R12.3 U3.7), Ultra-Mega-PS-PowerStage-V1.00 (U4.3)
ISENSE: Ultra-Mega-PS-DAC-V1.00 (U2.4), Ultra-Mega-PS-PowerStage-V1.00 (R17.2 R17.3 U6.7)
MISO: Ultra-Mega-PS-Block-V1.00 (CN1.9), Ultra-Mega-PS-DAC-V1.00 (U1.8 U2.8)
MOSI: Ultra-Mega-PS-Block-V1.00 (CN1.5), Ultra-Mega-PS-DAC-V1.00 (U1.13)
SCLK: Ultra-Mega-PS-Block-V1.00 (CN1.3), Ultra-Mega-PS-DAC-V1.00 (U1.14 U2.9)
VDAC: Ultra-Mega-PS-DAC-V1.00 (R11.2 R11.3 U3.1), Ultra-Mega-PS-PowerStage-V1.00 (U4.1)
VSENSE: Ultra-Mega-PS-DAC-V1.00 (U2.2), Ultra-Mega-PS-PowerStage-V1.00 (R25.2 R25.3 U6.1)